# Altium project EduBOT_v2.PrjPcb
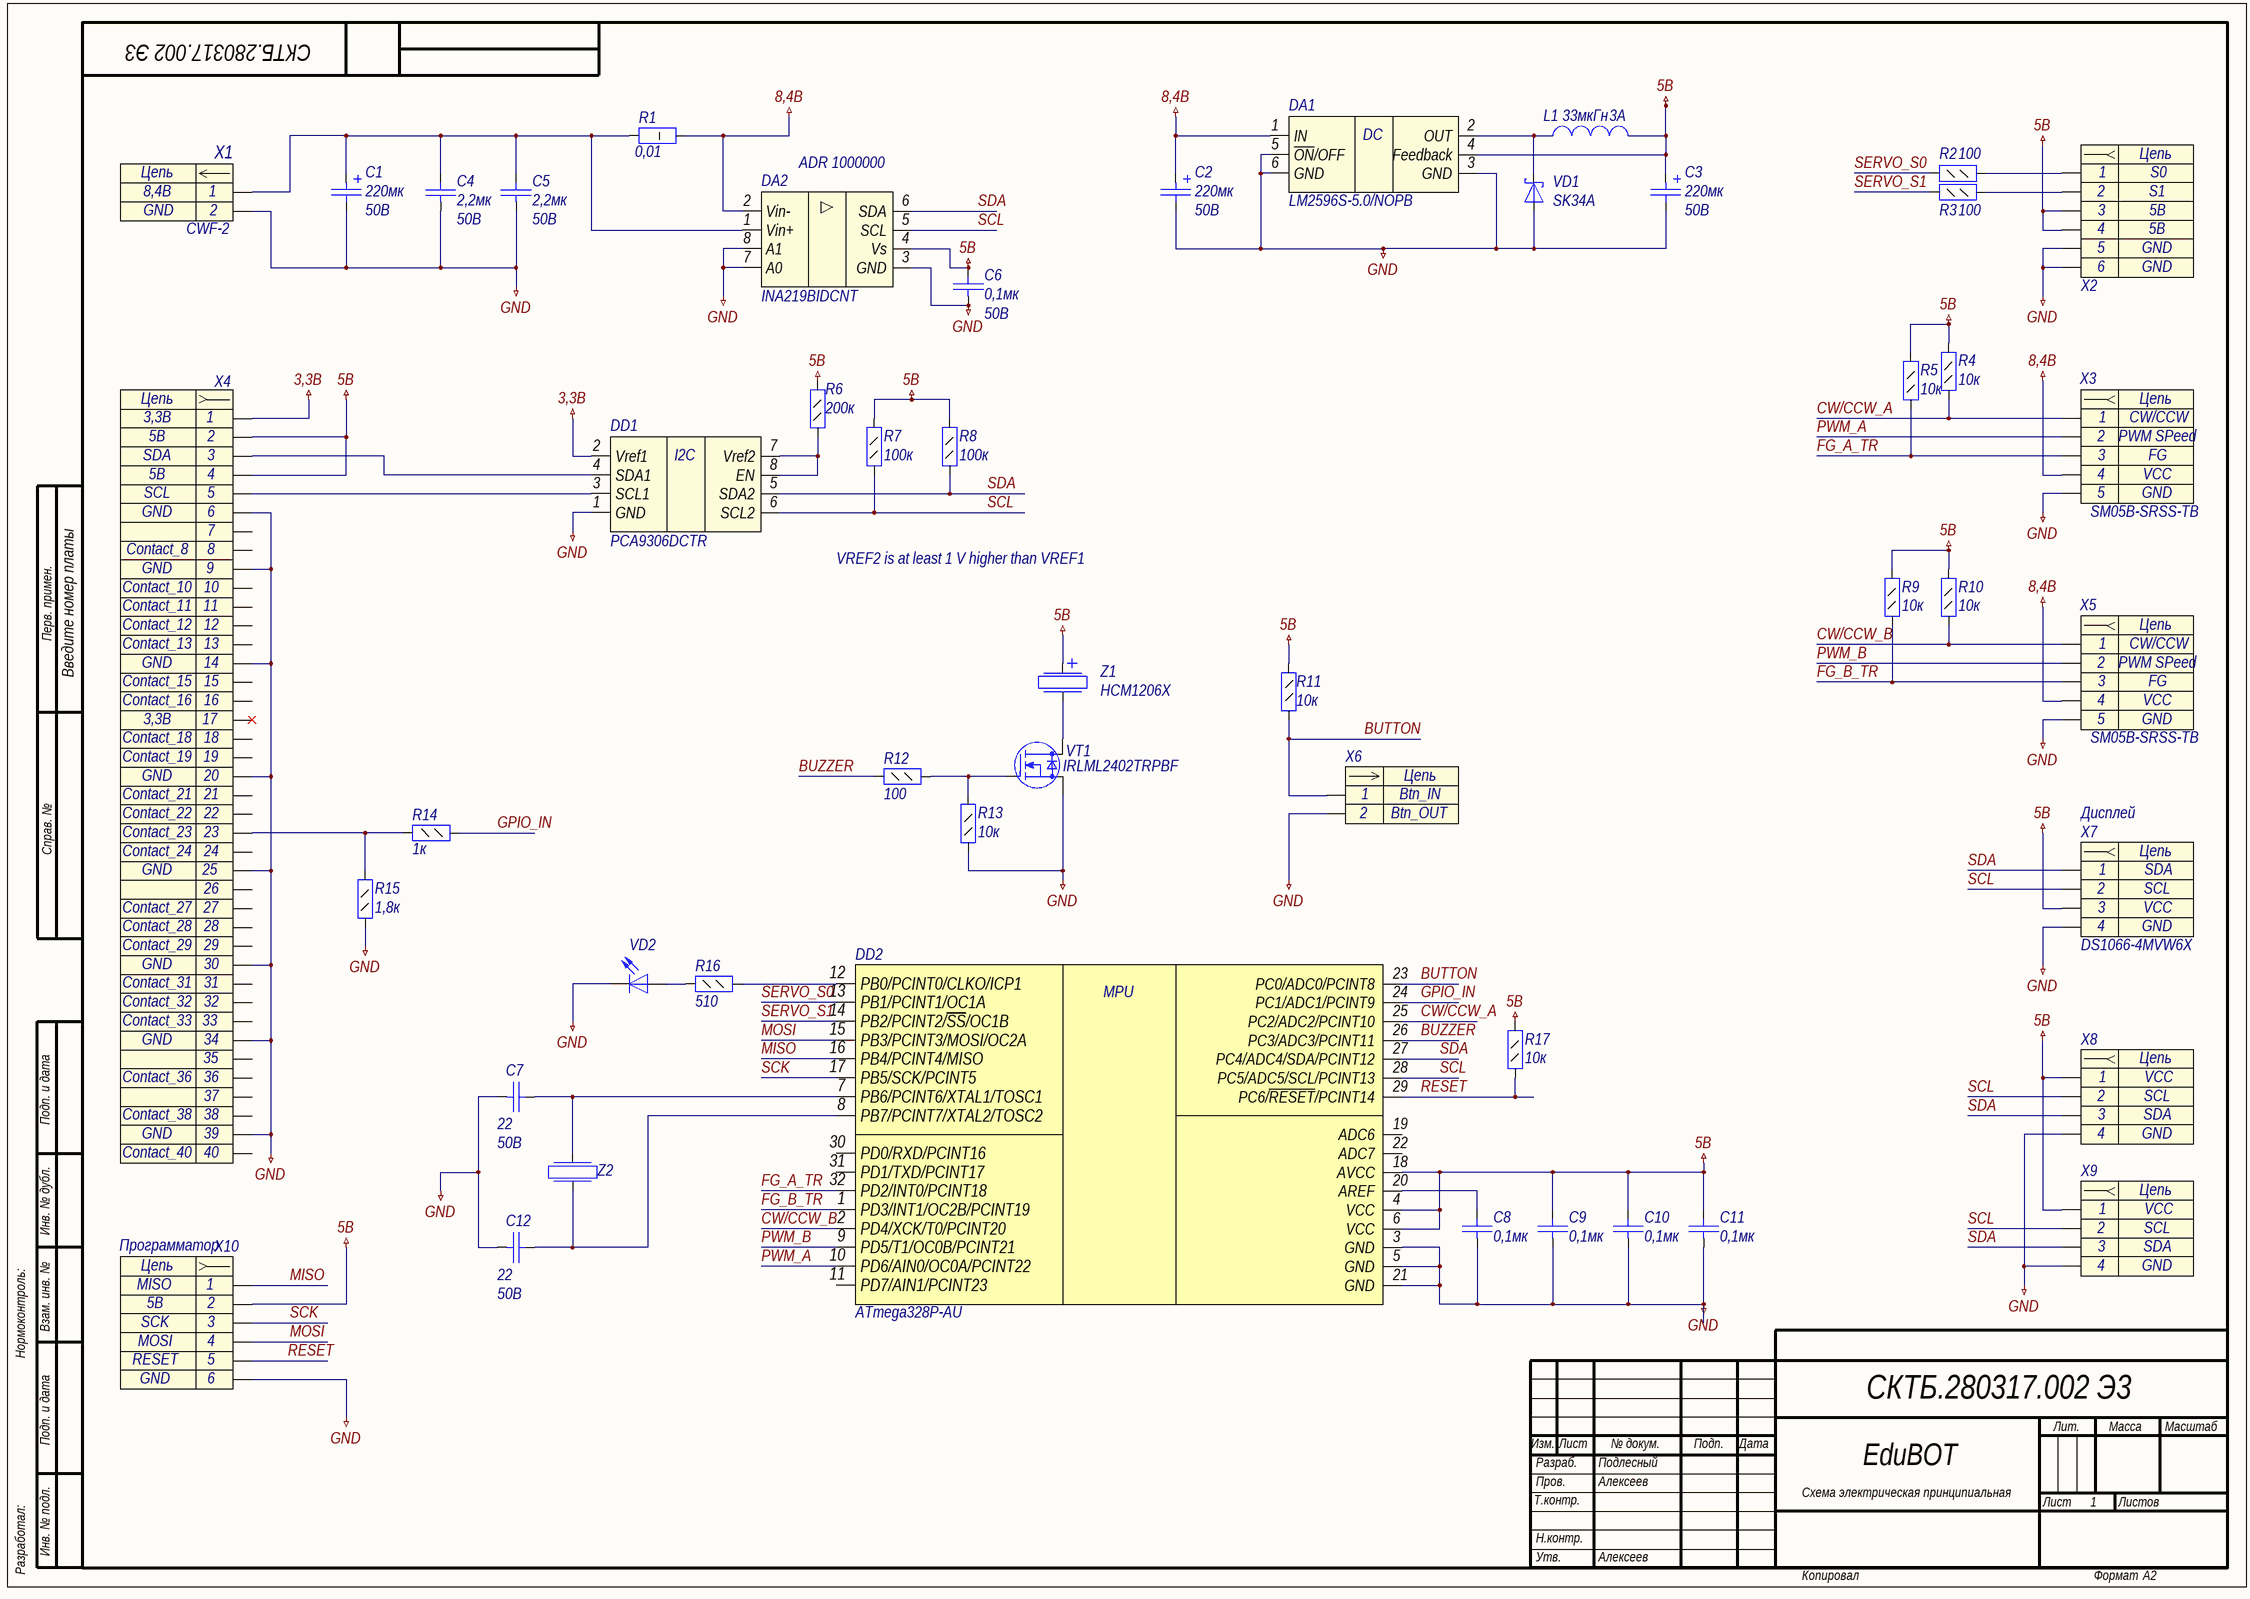
[diagram p0: EduBOT_v2.SchDoc]
1 sheet, 49 parts. Net scope: global (net labels, ports and power ports of the same name join across sheets).
Board file: EduBOT_v2.PcbDoc

## Sheet EduBOT_v2.SchDoc: Kapitoshka
size 594 x 420 mm; ApprovedBy: Алексеев; CheckedBy: Алексеев; DrawnBy: Подлесный; DocumentNumber: СКТБ.280317.002 Э3; SheetNumber: 1; Format: A2; DocumentType: Схема электрическая принципиальная; ImagePath: Введите номер платы

### Parts
C1  value 220мк  Voltage: 50В  [Cap_SMD_radial_polar(10x10.5)]  (hidden comment: Capacitor_pol)
C2  value 220мк  Voltage: 50В  [Cap_SMD_radial_polar(10x10.5)]  (hidden comment: Capacitor_pol)
C3  value 220мк  Voltage: 50В  [Cap_SMD_radial_polar(10x10.5)]  (hidden comment: Capacitor_pol)
C4  value 2,2мк  Voltage: 50В  [C1206]  (hidden comment: Capacitor)
C5  value 2,2мк  Voltage: 50В  [C1206]  (hidden comment: Capacitor)
C6  value 0,1мк  Voltage: 50В  [C0805]  (hidden comment: Capacitor)
C7  value 22  Voltage: 50В  [C0805]  (hidden comment: Capacitor)
C8  value 0,1мк  [C0805]  (hidden comment: Capacitor)
C9  value 0,1мк  [C0805]  (hidden comment: Capacitor)
C10  value 0,1мк  [C0805]  (hidden comment: Capacitor)
C11  value 0,1мк  [C0805]  (hidden comment: Capacitor)
C12  value 22  Voltage: 50В  [C0805]  (hidden comment: Capacitor)
DA1  Part Number: LM2596S-5.0/NOPB  [TO-263-5]  (hidden comment: LM2596S)
DA2  INA219BIDCNT  [SOT23-8]
DD1  PCA9306DCTR  [SSOP8]
DD2  ATmega328P-AU  [TQFP-32]
L1  value 33мкГн  Rated Current: 3A  [IND_12.8x12.8]  (hidden comment: Inductor)
R1  value 0,01  [R2512]  (hidden comment: Resistor_1Вт)
R2  value 100  [R0805]  (hidden comment: Resistor_0,125Вт)
R3  value 100  [R0805]  (hidden comment: Resistor_0,125Вт)
R4  value 10к  [R0805]  (hidden comment: Resistor_0,125Вт)
R5  value 10к  [R0805]  (hidden comment: Resistor_0,125Вт)
R6  value 200к  [R0805]  (hidden comment: Resistor_0,125Вт)
R7  value 100к  [R0805]  (hidden comment: Resistor_0,125Вт)
R8  value 100к  [R0805]  (hidden comment: Resistor_0,125Вт)
R9  value 10к  [R0805]  (hidden comment: Resistor_0,125Вт)
R10  value 10к  [R0805]  (hidden comment: Resistor_0,125Вт)
R11  value 10к  [R0805]  (hidden comment: Resistor_0,125Вт)
R12  value 100  [R0805]  (hidden comment: Resistor_0,125Вт)
R13  value 10к  [R0805]  (hidden comment: Resistor_0,125Вт)
R14  value 1к  [R0805]  (hidden comment: Resistor_0,125Вт)
R15  value 1,8к  [R0805]  (hidden comment: Resistor_0,125Вт)
R16  value 510  [R0805]  (hidden comment: Resistor_0,125Вт)
R17  value 10к  [R0805]  (hidden comment: Resistor_0,125Вт)
VD1  Part Number: SK34A  [SMA]  (hidden comment: DiodeSchottky)
VD2  LED  [L_0805]  (value not drawn)
VT1  Part Number: IRLML2402TRPBF  [SOT23-3]  (hidden comment: N-MOSFET)
X1  (no value)  [CWF-2]
X2  Header_6_sct  [PLS2-6]  (value not drawn)
X3  Двигатель А  [SM05B-SRSS-TB]  (value not drawn)
X4  (no value)  [PBS-40]
X5  Двигатель А  [SM05B-SRSS-TB]  (value not drawn)
X6  (no value)  [JUMPER_2.54]
X7  Дисплей  Part Number: DS1066-4MVW6X  [MW-4M]
X8  Header_4_sct  [RJ9_4P4C]  (value not drawn)
X9  Header_4_sct  [RJ9_4P4C]  (value not drawn)
X10  Программатор  [PLS2-6]
Z1  Part Number: HCM1206X  [Buzzer_gen_12mm]
Z2  Crystal  [HC-49S]  (value not drawn)

### Nets
3,3B: DD1.2(Vref1) X4.1
5В: C3.1 C6.2 C9.2 C10.2 C11.2 DA1.4(Feedback) DA2.4(Vs) DD2.4(VCC) DD2.6(VCC) DD2.18(AVCC) L1.2 R4.2 R5.2 R6.2 R7.2 R8.2 R9.2 R10.2 R11.1 R17.2 X2.3 X2.4 X4.2 X4.4 X7.3 X8.1 X9.1 X10.2 Z1.1
8,4В: C2.1 DA1.1(IN) DA2.2(Vin-) R1.2 X3.4 X5.4
GND: C1.2 C2.2 C3.2 C4.1 C5.1 C6.1 C7.1 C8.1 C9.1 C10.1 C11.1 C12.1 DA1.3(GND) DA1.5(~{ON}/OFF) DA1.6(GND) DA2.3(GND) DA2.7(A0) DA2.8(A1) DD1.1(GND) DD2.3(GND) DD2.5(GND) DD2.21(GND) R13.1 R15.1 VD1.2(A) VD2.1(K) VT1.3(S) X1.2 X2.5 X2.6 X3.5 X4.6 X4.9 X4.14 X4.20 X4.25 X4.30 X4.34 X4.39 X5.5 X6.2 X7.4 X8.4 X9.4 X10.6
BUTTON: DD2.23(PC0/ADC0/PCINT8) R11.2 X6.1
BUZZER: DD2.26(PC3/ADC3/PCINT11) R12.1
CW/CCW_A: DD2.25(PC2/ADC2/PCINT10) R4.1 X3.1
CW/CCW_B: DD2.2(PD4/XCK/T0/PCINT20) R10.1 X5.1
FG_A_TR: DD2.32(PD2/INT0/PCINT18) R5.1 X3.3
FG_B_TR: DD2.1(PD3/INT1/OC2B/PCINT19) R9.1 X5.3
GPIO_IN: DD2.24(PC1/ADC1/PCINT9) R14.1
MISO: DD2.16(PB4/PCINT4/MISO) X10.1
MOSI: DD2.15(PB3/PCINT3/MOSI/OC2A) X10.4
PWM_A: DD2.10(PD6/AIN0/OC0A/PCINT22) X3.2
PWM_B: DD2.9(PD5/T1/OC0B/PCINT21) X5.2
RESET: DD2.29(PC6/~{RESET}/PCINT14) R17.1 X10.5
SCK: DD2.17(PB5/SCK/PCINT5) X10.3
SCL: DA2.5(SCL) DD1.6(SCL2) DD2.28(PC5/ADC5/SCL/PCINT13) R7.1 X7.2 X8.2 X9.2
SDA: DA2.6(SDA) DD1.5(SDA2) DD2.27(PC4/ADC4/SDA/PCINT12) R8.1 X7.1 X8.3 X9.3
SERVO_S0: DD2.13(PB1/PCINT1/OC1A) R2.1
SERVO_S1: DD2.14(PB2/PCINT2/~{SS}/OC1B) R3.1
NetC1_1: C1.1 C4.2 C5.2 DA2.1(Vin+) R1.1 X1.1
NetC7_2: C7.2 DD2.7(PB6/PCINT6/XTAL1/TOSC1) Z2.2
NetC8_2: C8.2 DD2.20(AREF)
NetC12_2: C12.2 DD2.8(PB7/PCINT7/XTAL2/TOSC2) Z2.1
NetDA1_2: DA1.2(OUT) L1.1 VD1.1(K)
NetDD1_3: DD1.3(SCL1) X4.5
NetDD1_4: DD1.4(SDA1) X4.3
NetDD1_7: DD1.7(Vref2) DD1.8(EN) R6.1
NetDD2_12: DD2.12(PB0/PCINT0/CLKO/ICP1) R16.2
NetR2_2: R2.2 X2.1
NetR3_2: R3.2 X2.2
NetR12_2: R12.2 R13.2 VT1.1(G)
NetR14_2: R14.2 R15.2 X4.23
NetR16_1: R16.1 VD2.2(A)
NetVT1_2: VT1.2(D) Z1.2

Not connected (* = marked no-connect by the designer): DD2 11(PD7/AIN1/PCINT23) 19(ADC6) 22(ADC7) 30(PD0/RXD/PCINT16) 31(PD1/TXD/PCINT17); X4 7 8 10 11 12 13 15 16 17* 18 19 21 22 24 26 27 28 29 31 32 33 35 36 37 38 40

### Notes on the sheet
- (near DA2) ADR 1000000
- Перв. примен.
- (near DD1) VREF2 is at least 1 V higher than VREF1
- Справ. №
- Подп. и дата
- Инв. № дубл.
- Нормоконтроль:
- Взам. инв. №
- Изм.
- Лист
- № докум.
- Подп.
- Дата
- Лит.
- Масса
- Масштаб
- Т.контр.
- Пров.
- Разраб.
- EduBOT
- Листов
- Разработал:
- Инв. № подл.
- Н.контр.
- Утв.
- Копировал
- Формат
- (in symbol connect0) Цепь
- (in symbol connect15) Цепь
- (in symbol connect54) Цепь
- (in symbol connect72) Цепь
- (in symbol connect80) Цепь
- (in symbol connect113) Цепь
- (in symbol Header_40) Цепь
- (in symbol interf13) I2C
- (in symbol microcont1) MPU
- (in symbol pwr3) DC

### Library data of the parts
C1-C3 = cap194: Конденсатор полярный; Part Name: Capacitors_pol; Manufacture: Epcos; Part Number: ECAP SMD; id: cap194
C4 C5 = cap188: Конденсатор; Part Name: Capacitors; Part Number: GRM31CR71H225KA88**L; id: cap188; TKE: X7R
C6 C8-C11 = cap161: Конденсатор; Part Name: Capacitors; Part Number: GRM21BR71H104KA01L; id: cap161; TKE: X7R
C7 C12 = cap223: Конденсатор; Part Name: Ceramic; Manufacture: Murata; Part Number: GRM21A5C2E220JW01D; id: cap223; TKE: X7R
DA1 = pwr3: 3-A Step-Down Voltage Regulator; Part Name: 3A Step-Down Voltage Regulator; Manufacturer: Texas Instruments; id: pwr3; Input Voltage: 40B; Output Voltage: 5B; Current: 3A; Type: Impulse
DA2 = interf16: Токочувствительный усилитель; Part Name: Current/Power Monitor With I 2C Interface; Manufacture: Texas Instruments; Resolution: 12bit; Address: A0 A1 adress pin; Offset voltage: 40uB; Bandwidth: 11kHz; CMRR: 120dB; Number of Channel: 1; Input channel: diff; Type Supply: Single Polar; Power Supply: 3.0-5.5V; id: interf16; Part Number: INA219BIDCNT
DD1 = interf13: DUAL BIDIRECTIONAL I2C BUS AND SMBus VOLTAGE-LEVEL TRANSLATOR; Part Name: I²C/SMBus Voltage-Level Translator; Manufacture: Texas Instruments; Vref output: 0-5V; Type Supply: Single Polar; id: interf13; Power Supply: 0-5V; Part Number: PCA9306DCTR
DD2 = microcont1: Микроконтроллер 8-Бит, picoPower, AVR, 20МГц, 32КБ Flash; Part Name: Microcontroller; Frequency: 20MHz; ADC: 8x10b; Interface: i2c, spi, uart; Flash: 32kb; Pin in: 23; Power Supply: 1.8-5.5 V; id: microcont1; Part Number: ATmega328P-AU
L1 = ind80: EMI Suppression Filter; Part Name: SMD Power Inductors; Part Number: B82477G4333M000; Manufacture: Epcos; id: ind80; Saturation Current: 3,5A; Resistance: 0,053Ohm
R1 = res777: Резистор; Manufacture: Yageo; Part Number: RL2512FK-070R01L; id: res777; Power: 1Вт; Part Name: Resistor; Accuracy: 0,01
R2 R3 R12 = res49: Резистор; Manufacture: Yageo; Part Number: RC0805FR-07100RL; id: res49; Accuracy: 0,01; Part Name: Resistor; Power: 0,125Вт
R4 R5 R9 R10 R13 R17 = res97: Резистор; Manufacture: Yageo; Part Number: RC0805FR-0710KL; id: res97; Accuracy: 0,01; Part Name: Resistor; Power: 0,125Вт
R6 = res132: Резистор; Manufacture: Yageo; Part Number: RC0805FR-07200KL; id: res132; Accuracy: 0,01; Part Name: Resistor; Power: 0,125Вт
R7 R8 = res125: Резистор; Manufacture: Yageo; Part Number: RC0805FR-07100KL; id: res125; Accuracy: 0,01; Part Name: Resistor; Power: 0,125Вт
R11 = res97: Резистор; id: res97; Accuracy: 1%; Part Name: Resistor; Power: 0,125Вт
R14 = res76: Резистор; Manufacture: Yageo; Part Number: RC0805FR-071KL; id: res76; Accuracy: 0,01; Part Name: Resistor; Power: 0,125Вт
R15 = res83: Резистор; Manufacture: Yageo; Part Number: RC0805FR-071K8; id: res83; Accuracy: 0,01; Part Name: Resistor; Power: 0,125Вт
R16 = res66: Резистор; Manufacture: Yageo; Part Number: RC0805FR-07510RL; id: res66; Accuracy: 0,01; Part Name: Resistor; Power: 0,125Вт
VD1 = diode1: Диод Шоттки; Manufacture: Taiwan Semiconductor; id: diode1; Max Reverse Voltage: 40B; Forward Voltage: 0,55B; Forward Current: 3A; Part Name: Diode Schottky
VD2 = diode5: Светодиод; Part Number: KP-2012EC; id: diode5; Part Name: LED
VT1 = mosfert2: Manufacturer: International Rectifier; Structure: n-channel; V drain-source max: 20B; Rds: 0,25Ohm; Gate-to-source voltage: (+-)12B; Continuous drain current: 1,2A; Total gate charge: 2,6nC; Pulsed drain current: 7,4A; Power dissipation: 0,54W; id: mosfert2
X1 = connect15: Разъем - 2 конт. вилка; Part Number: DS1069-2MVW6X; Manufacture: Ningbo connfly electronic; Contact_1: 8,4B; Contact_2: GND; Etch: 2,5mm; Part Name: CWF-2; id: connect15
X2 = connect0: Разъем - 6 конт. розетка; Part Name: MKII; Contact_1: S0; Contact_2: S1; Contact_3: 5B; Contact_5: GND; Contact_4: 5B; Contact_6: GND; id: connect0
X3 X5 = connect113: Разъем - 5 конт. розетка; Part Name: ShroudedHeader; Manufacture: JST Sales; Contact_1: CW/CCW; Contact_2: PWM SPeed; Contact_3: FG; Contact_4: VCC; Contact_5: GND; Etch: 1mm; id: connect113; Part Number: SM05B-SRSS-TB
X4 = Header_40: Разъем - 5 конт. розетка; Contact_1: 3,3B; Contact_2: 5B; Contact_3: SDA; Contact_5: SCL; Contact_6: GND; Contact_8: Contact_8; Contact_9: GND; Contact_10: Contact_10; Contact_11: Contact_11; Contact_12: Contact_12; Contact_13: Contact_13; Contact_14: GND; Contact_15: Contact_15; Contact_16: Contact_16; Contact_17: 3,3B; Contact_18: Contact_18; Contact_19: Contact_19; Contact_20: GND; Contact_21: Contact_21; Contact_22: Contact_22; Contact_23: Contact_23; Contact_24: Contact_24; Contact_25: GND; Contact_27: Contact_27; Contact_28: Contact_28; Contact_29: Contact_29; Contact_30: GND; Contact_31: Contact_31; Contact_32: Contact_32; Contact_33: Contact_33; Contact_34: GND; Contact_36: Contact_36; Contact_38: Contact_38; Contact_39: GND; Contact_40: Contact_40; Contact_4: 5B
X6 = connect54: Разъем - 2 конт. вилка; Part Name: Jumper 2,54mm; Contact_1: Btn_IN; Contact_2: Btn_OUT; Etch: 2,54mm; id: connect54
X7 = connect80: Разъем - 4 конт. розетка; Part Name: Вилка на плату прямая 2мм 4pin; Manufacture: Ningbo connfly electronic; Contact_1: SDA; Contact_2: SCL; Contact_3: VCC; Contact_4: GND; Etch: 2mm; id: connect80
X8 X9 = connect72: Разъем - 4 конт. розетка; Part Name: Rj9; Contact_1: VCC; Contact_2: SCL; Contact_3: SDA; Contact_4: GND; id: connect72
X10 = connect0: Разъем - 6 конт. розетка; Part Name: MKII; Contact_1: MISO; Contact_2: 5B; Contact_3: SCK; Contact_4: MOSI; Contact_5: RESET; Contact_6: GND; id: connect0
Z1 = buzzer2: Пьезоизлучатель звуковой без генератора; Frequence: 2300Hz; Generator: yes; Intensity: 85dB; Supply Voltage: 12B; Max  Current: 30mA; id: buzzer2
Z2 = crystal7: Кварцевый резонатор; Part Number: 16.000MHzHC-49US; Frequence: 16MHz; id: crystal7